# EAGLE schematic Reaccion (EAGLE 6.4)
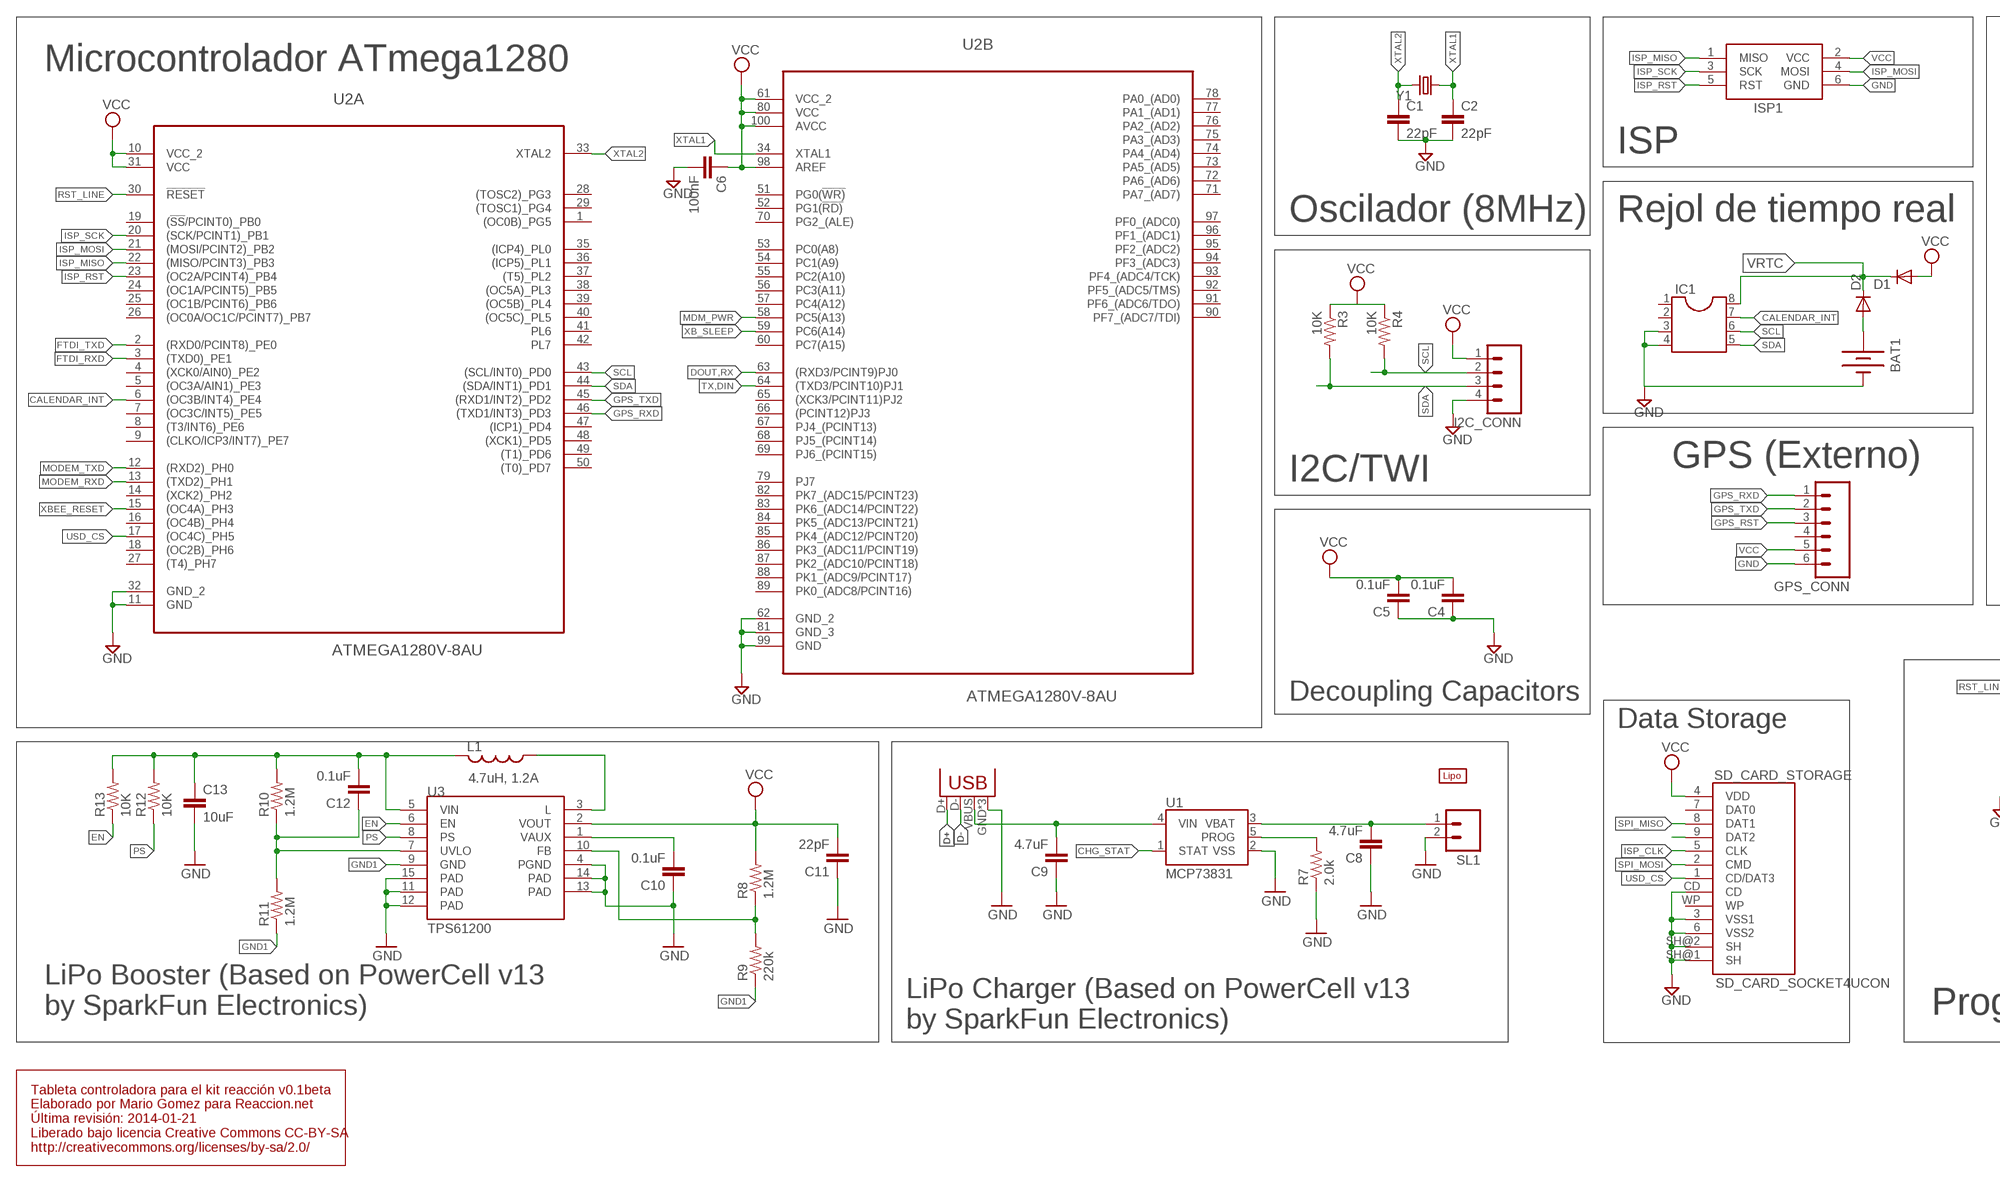
[diagram p0: schematic, sheet 1, part 1 of 2]
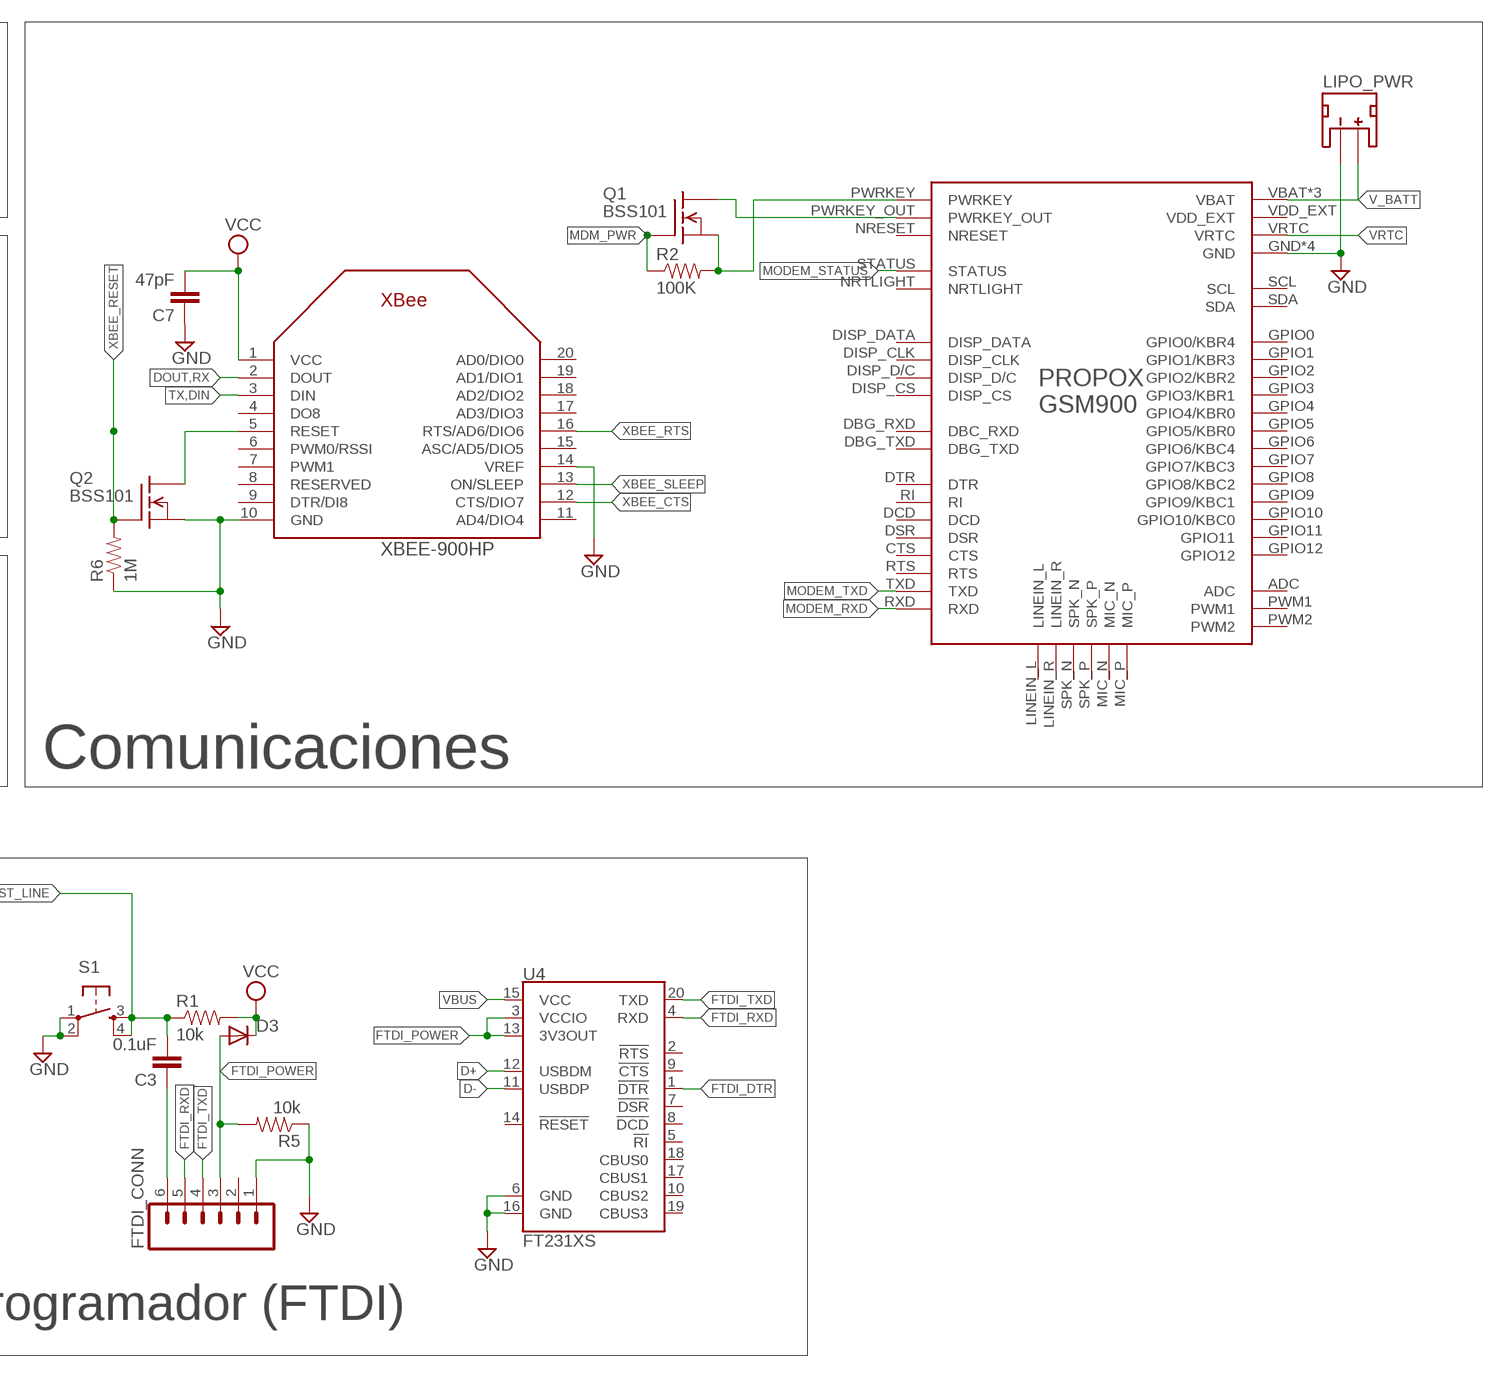
[diagram p1: schematic, sheet 1, part 2 of 2]

## Parts
BAT1  BATTERY12PTH  [BATTCON_12MM_PTH]
C1  22pF  CAP0805  [0805]
C2  22pF  CAP0805  [0805]
C3  0.1uF  CAP0805  [0805]
C4  0.1uF  1.0UF-25V-+80/-20(0805)  [0805]
C5  0.1uF  CAP0805  [0805]
C6  100nF  CAP0805  [0805]
C7  47pF  1.0UF-25V-+80/-20(0805)  [0805]
C8  4.7uF  4.7UF-6.3V-10%(0603)0603  [0603-CAP]
C9  4.7uF  4.7UF-6.3V-10%(0603)0603  [0603-CAP]
C10  0.1uF  1.0UF-25V-+80/-20(0805)  [0805]
C11  22pF  1.0UF-25V-+80/-20(0805)  [0805]
C12  0.1uF  1.0UF-25V-+80/-20(0805)  [0805]
C13  10uF  2.2UF-CERCAP-10009  [1206]
D1  DIODESOD  [SOD-323]
D2  DIODESOD  [SOD-323]
D3  DIODESOD  [SOD-323]
FTDI_CONN  M06SIP  [1X06]
GPS_CONN  M06SIP  [1X06]
GSM_MODEM  PROPOXGSM900  [CONN-13X2]
I2C_CONN  M04PTH  [1X04]
IC1  DIL8  [DIL08]
ISP1  AVRISP-6  [AVRISP]
JP1  USB-MICROB  [USB-MICROB]
L1  4.7uH, 1.2A  INDUCTOR.  [CDRH2D09]
LIPO_PWR  JST_2MM_MALE  [JST-2-SMD]
Q1  BSS101  [TO92]
Q2  BSS101  [TO92]
R1  10k  RESISTOR0805-RES  [0805]
R2  100K  RESISTOR0805-RES  [0805]
R3  10K  RESISTOR0805-RES  [0805]
R4  10K  RESISTOR0805-RES  [0805]
R5  10k  RESISTOR0805-RES  [0805]
R6  1M  RESISTOR0805-RES  [0805]
R7  2.0k  2.0KOHM1/10W5%(0603)  [0603-RES]
R8  1.2M  2.0KOHM1/10W5%(0603)  [0603-RES]
R9  220k  2.0KOHM1/10W5%(0603)  [0603-RES]
R10  1.2M  2.0KOHM1/10W5%(0603)  [0603-RES]
R11  1.2M  2.0KOHM1/10W5%(0603)  [0603-RES]
R12  10K  2.0KOHM1/10W5%(0603)  [0603-RES]
R13  10K  2.0KOHM1/10W5%(0603)  [0603-RES]
S1  TAC_SWITCHPTH  [TACTILE-PTH]
SD_CARD_STORAGE  SD_CARD_SOCKET4UCON  [SDCARD_4UCONN]
SL1  M02  [02P]
U1  MCP73831  [SOT23-5]
U2  ATMEGA1280V-8AU  [QFP50P1600X1600X120-100N]
U3  TPS61200  [QFN-10_PAD]
U4  FT231XS  [SSOP20_L]
U$2  LIPO-OUTLINE2000  [LIPO-2000]
XBEE-900HP  XBEE  [XBEE]
Y1  CRYSTAL10.5X4.8  [CRYSTAL-SMD-10.5X4.8-2PIN]

## Nets
CALENDAR_INT: IC1.7 U2.6(A:(OC3B/INT4)_PE4)
CHG_STAT: U1.1(STAT)
D+: JP1.D+ U4.12(USBDM)
D-: JP1.D- U4.11(USBDP)
DOUT,RX: U2.63(B:(RXD3/PCINT9)PJ0) XBEE-900HP.2(DOUT)
EN: R13.1 U3.6(EN)
FTDI_DTR: C3.1 FTDI_CONN.6 U4.1(!DTR)
FTDI_POWER: D3.2(A) FTDI_CONN.3 R5.2 U4.3(VCCIO) U4.13(3V3OUT)
FTDI_RXD: FTDI_CONN.5 U2.3(A:(TXD0)_PE1) U4.4(RXD)
FTDI_TXD: FTDI_CONN.4 U2.2(A:(RXD0/PCINT8)_PE0) U4.20(TXD)
GND: BAT1.GND(-) C1.2 C2.2 C4.1 C5.1 C6.2 C7.1 C8.1 C9.1 C10.1 C11.1 C13.2 FTDI_CONN.1 GPS_CONN.6 GSM_MODEM.GND GSM_MODEM.GND2(GND) GSM_MODEM.GND3(GND) GSM_MODEM.GND4(GND) I2C_CONN.4 IC1.3 IC1.4 ISP1.6(GND) JP1.GND JP1.MT1(GND) JP1.MT2(GND) LIPO_PWR.1(-) Q2.1(S) R5.1 R6.1 R7.1 S1.1 S1.2 SD_CARD_STORAGE.3(VSS1) SD_CARD_STORAGE.6(VSS2) SD_CARD_STORAGE.CD SD_CARD_STORAGE.SH@1(SH) SD_CARD_STORAGE.SH@2(SH) SL1.2 U1.2(VSS) U2.11(A:GND) U2.32(A:GND_2) U2.62(B:GND_2) U2.81(B:GND_3) U2.99(B:GND) U3.4(PGND) U3.11(PAD) U3.12(PAD) U3.13(PAD) U3.14(PAD) U3.15(PAD) U4.6(GND) U4.16(GND) XBEE-900HP.10(GND) XBEE-900HP.14(VREF)
GND1: R9.1 R11.1 U3.9(GND)
GPS_RST: GPS_CONN.3
GPS_RXD: GPS_CONN.1 U2.46(A:(TXD1/INT3)_PD3)
GPS_TXD: GPS_CONN.2 U2.45(A:(RXD1/INT2)_PD2)
ISP_CLK: SD_CARD_STORAGE.5(CLK)
ISP_MISO: ISP1.1(MISO) U2.22(A:(MISO/PCINT3)_PB3)
ISP_MOSI: ISP1.4(MOSI) U2.21(A:(MOSI/PCINT2)_PB2)
ISP_RST: ISP1.5(RST) U2.23(A:(OC2A/PCINT4)_PB4)
ISP_SCK: ISP1.3(SCK) U2.20(A:(SCK/PCINT1)_PB1)
MDM_PWR: Q1.2(G) R2.1 U2.58(B:PC5(A13))
MODEM_RXD: GSM_MODEM.RXD U2.13(A:(TXD2)_PH1)
MODEM_STATUS: GSM_MODEM.STATUS
MODEM_TXD: GSM_MODEM.TXD U2.12(A:(RXD2)_PH0)
N$1: BAT1.VCC@1(+) D2.2(A)
N$2: SD_CARD_STORAGE.9(DAT2)
N$4: R7.2 U1.5(PROG)
N$5: Q2.3(D) XBEE-900HP.5(RESET)
N$6: GSM_MODEM.PWRKEY_OUT Q1.3(D)
N$7: GSM_MODEM.PWRKEY Q1.1(S) R2.2
N$9: C10.2 U3.1(VAUX)
N$10: R8.1 R9.2 U3.10(FB)
N$11: L1.P$1 U3.3(L)
N$12: C12.1 R10.1 R11.2 U3.7(UVLO)
PS: R12.1 U3.8(PS)
RST_LINE: C3.2 R1.1 S1.3 S1.4 U2.30(A:!RESET)
SCL: I2C_CONN.2 IC1.6 R4.2 U2.43(A:(SCL/INT0)_PD0)
SDA: I2C_CONN.3 IC1.5 R3.2 U2.44(A:(SDA/INT1)_PD1)
SPI_MISO: SD_CARD_STORAGE.8(DAT1)
SPI_MOSI: SD_CARD_STORAGE.2(CMD)
TX,DIN: U2.64(B:(TXD3/PCINT10)PJ1) XBEE-900HP.3(DIN)
USD_CS: SD_CARD_STORAGE.1(CD/DAT3) U2.17(A:(OC4C)_PH5)
V_BATT: C8.2 C12.2 C13.1 GSM_MODEM.VBAT GSM_MODEM.VBAT2(VBAT) GSM_MODEM.VBAT3(VBAT) L1.P$2 LIPO_PWR.2(+) R10.2 R12.2 R13.2 SL1.1 U1.3(VBAT) U3.5(VIN)
VBUS: C9.2 JP1.VBUS U1.4(VIN) U4.15(VCC)
VCC: C4.2 C5.2 C6.1 C7.2 C11.2 D1.2(A) D3.1(C) GPS_CONN.5 I2C_CONN.1 ISP1.2(VCC) R1.2 R3.1 R4.1 R8.2 SD_CARD_STORAGE.4(VDD) U2.10(A:VCC_2) U2.31(A:VCC) U2.61(B:VCC_2) U2.80(B:VCC) U2.98(B:AREF) U2.100(B:AVCC) U3.2(VOUT) XBEE-900HP.1(VCC)
VRTC: D1.1(C) D2.1(C) GSM_MODEM.VRTC IC1.8
XB_SLEEP: U2.59(B:PC6(A14))
XBEE_CTS: XBEE-900HP.12(CTS/DIO7)
XBEE_RESET: Q2.2(G) R6.2 U2.15(A:(OC4A)_PH3)
XBEE_RTS: XBEE-900HP.16(RTS/AD6/DIO6)
XBEE_SLEEP: XBEE-900HP.13(ON/SLEEP)
XTAL1: C2.1 U2.34(B:XTAL1) Y1.P$1
XTAL2: C1.1 U2.33(A:XTAL2) Y1.P$2
Unconnected: FTDI_CONN.2 GPS_CONN.4 GSM_MODEM.ADC GSM_MODEM.CTS GSM_MODEM.DBG_RXD(DBC_RXD) GSM_MODEM.DBG_TXD GSM_MODEM.DCD GSM_MODEM.DISP_CLK GSM_MODEM.DISP_CS GSM_MODEM.DISP_D/C GSM_MODEM.DISP_DATA GSM_MODEM.DSR GSM_MODEM.DTR GSM_MODEM.GPIO0(GPIO0/KBR4) GSM_MODEM.GPIO1(GPIO1/KBR3) GSM_MODEM.GPIO2(GPIO2/KBR2) GSM_MODEM.GPIO3(GPIO3/KBR1) GSM_MODEM.GPIO4(GPIO4/KBR0) GSM_MODEM.GPIO5(GPIO5/KBR0) GSM_MODEM.GPIO6(GPIO6/KBC4) GSM_MODEM.GPIO7(GPIO7/KBC3) GSM_MODEM.GPIO8(GPIO8/KBC2) GSM_MODEM.GPIO9(GPIO9/KBC1) GSM_MODEM.GPIO10(GPIO10/KBC0) GSM_MODEM.GPIO11 GSM_MODEM.GPIO12 GSM_MODEM.LINEIN_L GSM_MODEM.LINEIN_R GSM_MODEM.MIC_N GSM_MODEM.MIC_P GSM_MODEM.NRESET GSM_MODEM.NRTLIGHT GSM_MODEM.PWM1 GSM_MODEM.PWM2 GSM_MODEM.RI GSM_MODEM.RTS GSM_MODEM.SCL GSM_MODEM.SDA GSM_MODEM.SPK_N GSM_MODEM.SPK_P GSM_MODEM.VDD_EXT IC1.1 IC1.2 LIPO_PWR.NC1(PAD1) LIPO_PWR.NC2(PAD2) SD_CARD_STORAGE.7(DAT0) SD_CARD_STORAGE.WP U2.1(A:(OC0B)_PG5) U2.4(A:(XCK0/AIN0)_PE2) U2.5(A:(OC3A/AIN1)_PE3) U2.7(A:(OC3C/INT5)_PE5) U2.8(A:(T3/INT6)_PE6) U2.9(A:(CLKO/ICP3/INT7)_PE7) U2.14(A:(XCK2)_PH2) U2.16(A:(OC4B)_PH4) U2.18(A:(OC2B)_PH6) U2.19(A:(!SS!/PCINT0)_PB0) U2.24(A:(OC1A/PCINT5)_PB5) U2.25(A:(OC1B/PCINT6)_PB6) U2.26(A:(OC0A/OC1C/PCINT7)_PB7) U2.27(A:(T4)_PH7) U2.28(A:(TOSC2)_PG3) U2.29(A:(TOSC1)_PG4) U2.35(A:(ICP4)_PL0) U2.36(A:(ICP5)_PL1) U2.37(A:(T5)_PL2) U2.38(A:(OC5A)_PL3) U2.39(A:(OC5B)_PL4) U2.40(A:(OC5C)_PL5) U2.41(A:PL6) U2.42(A:PL7) U2.47(A:(ICP1)_PD4) U2.48(A:(XCK1)_PD5) U2.49(A:(T1)_PD6) U2.50(A:(T0)_PD7) U2.51(B:PG0(!WR)) U2.52(B:PG1(!RD)) U2.53(B:PC0(A8)) U2.54(B:PC1(A9)) U2.55(B:PC2(A10)) U2.56(B:PC3(A11)) U2.57(B:PC4(A12)) U2.60(B:PC7(A15)) U2.65(B:(XCK3/PCINT11)PJ2) U2.66(B:(PCINT12)PJ3) U2.67(B:PJ4_(PCINT13)) U2.68(B:PJ5_(PCINT14)) U2.69(B:PJ6_(PCINT15)) U2.70(B:PG2_(ALE)) U2.71(B:PA7_(AD7)) U2.72(B:PA6_(AD6)) U2.73(B:PA5_(AD5)) U2.74(B:PA4_(AD4)) U2.75(B:PA3_(AD3)) U2.76(B:PA2_(AD2)) U2.77(B:PA1_(AD1)) U2.78(B:PA0_(AD0)) U2.79(B:PJ7) U2.82(B:PK7_(ADC15/PCINT23)) U2.83(B:PK6_(ADC14/PCINT22)) U2.84(B:PK5_(ADC13/PCINT21)) U2.85(B:PK4_(ADC12/PCINT20)) U2.86(B:PK3_(ADC11/PCINT19)) U2.87(B:PK2_(ADC10/PCINT18)) U2.88(B:PK1_(ADC9/PCINT17)) U2.89(B:PK0_(ADC8/PCINT16)) U2.90(B:PF7_(ADC7/TDI)) U2.91(B:PF6_(ADC6/TDO)) U2.92(B:PF5_(ADC5/TMS)) U2.93(B:PF4_(ADC4/TCK)) U2.94(B:PF3_(ADC3)) U2.95(B:PF2_(ADC2)) U2.96(B:PF1_(ADC1)) U2.97(B:PF0_(ADC0)) U4.2(!RTS) U4.5(!RI) U4.7(!DSR) U4.8(!DCD) U4.9(!CTS) U4.10(CBUS2) U4.14(!RESET) U4.17(CBUS1) U4.18(CBUS0) U4.19(CBUS3) XBEE-900HP.4(DO8) XBEE-900HP.6(PWM0/RSSI) XBEE-900HP.7(PWM1) XBEE-900HP.8(RESERVED) XBEE-900HP.9(DTR/DI8) XBEE-900HP.11(AD4/DIO4) XBEE-900HP.15(ASC/AD5/DIO5) XBEE-900HP.17(AD3/DIO3) XBEE-900HP.18(AD2/DIO2) XBEE-900HP.19(AD1/DIO1) XBEE-900HP.20(AD0/DIO0)

## Notes on the sheet
- Microcontrolador ATmega1280
- ISP
- Oscilador (8MHz) | Rejol de tiempo real
- GPS (Externo)
- I2C/TWI
- Comunicaciones
- Decoupling Capacitors
- Data Storage
- LiPo Booster (Based on PowerCell v13
  by SparkFun Electronics)
- Programador (FTDI)
- LiPo Charger (Based on PowerCell v13
  by SparkFun Electronics)
- Tableta controladora para el kit reacción v0.1beta
  Elaborado por Mario Gomez para Reaccion.net
  Última revisión: 2014-01-21
  Liberado bajo licencia Creative Commons CC-BY-SA
  http://creativecommons.org/licenses/by-sa/2.0/

## Library data of the parts
BAT1 = SparkFun-Electromechanical:BATTERY: Battery Holders Various common sizes : AA, AAA, 20mm coin cell and 12mm coin cell. 20MM_4LEGS, BATT-10373
C1-C3 C5 C6 = SparkFun-Capacitors:CAP: Capacitor Standard 0603 ceramic capacitor, and 0.1" leaded capacitor.
C4 C7 C10-C12 = SparkFun-Capacitors:1.0UF-25V-+80/-20(0805); PROD_ID: CAP-11625; VALUE: 1.0uF
C8 C9 = SparkFun-Capacitors:4.7UF-6.3V-10%(0603): CAP-08280; PROD_ID: CAP-08280
C13 = SparkFun-Capacitors:2.2UF-CER: 2.2uF Ceramic SMT CAP-07888- 10V, 20% (0603) CAP-10009- 50V, 10% (1206); PROD_ID: CAP-10009; VALUE: 2.2uF
D1-D3 = SparkFun-DiscreteSemi:DIODE: Diode These are standard reverse protection diodes and small signal diodes. SMA package can handle up to about 1A. SOD-323 can handle about 200mA. What the SOD-323 package when ordering, there are some mfgs out there that are 5-pin packages.; PROD_ID: DIO-09646
FTDI_CONN GPS_CONN = SparkFun-Connectors:M06: Header 6 Standard 6-pin 0.1" header. Use with straight break away headers (SKU : PRT-00116), right angle break away headers (PRT-00553), swiss pins (PRT-00743), machine pins (PRT-00117), and female headers (PRT-00115). Molex polarized connector foot print use with SKU : PRT-08094 with associated crimp pins and housings. NOTES ON THE VARIANTS LOCK and LOCK_LONGPADS... This footprint was designed to help hold the alignment of a through-hole component (i.e. 6-pin header) while soldering it into place. You may notice that each hole has been shifted either up or down by 0.005 of an inch from it's more standard position (which is a perfectly straight line). This slight alteration caused the pins (the squares in the middle) to touch the edges of the holes. Because they are alternating, it causes a "brace" to hold the component in place. 0.005 has proven to be the perfect amount of "off-center" position when using our standard breakaway headers. Although looks a little odd when you look at the bare footprint, once you have a header in there, the alteration is very hard to notice. Also,if you push a header all the way into place, it is covered up entirely on the bottom side. This idea of altering the position of holes to aid alignment will be further integrated into the Sparkfun Library for other footprints. It can help hold any component with 3 or more connection pins.
GSM_MODEM = PROPOX:PROPOXGSM900
I2C_CONN = SparkFun-Connectors:M04: Header 4 Standard 4-pin 0.1" header. Use with straight break away headers (SKU : PRT-00116), right angle break away headers (PRT-00553), swiss pins (PRT-00743), machine pins (PRT-00117), and female headers (PRT-00115). Molex polarized connector foot print use with SKU : PRT-08231 with associated crimp pins and housings. 1MM SMD Version SKU: PRT-10208
IC1 = ic-package:DIL8: Dual In Line / Socket
ISP1 = adafruit:AVRISP: AVR ISP HEADER Standard 6 pin header for AVR programming
JP1 = SparkFun-Connectors:USB: USB Connectors USB-B-PTH is fully proven SKU : PRT-00139/CONN-08278 USB-miniB is fully proven SKU : PRT-00587 USB-A-PCB is untested. USB-A-H is throughly reviewed, but untested. Spark Fun Electronics SKU : PRT-00437 USB-B-SMT is throughly reviewed, but untested. Needs silkscreen touching up. USB-A-S has not been used/tested USB-MB-H has not been used/tested USB-MICROB has been used. CONN-09505; PROD_ID: CONN-09505
L1 = SparkFun-Passives:INDUCTOR: Inductors Basic Inductor/Choke - 0603 and 1206. Footprints are not proven and vary greatly between part numbers. SRN6045- 33uH, 20% 1.4A SDR0403-560KL - 56uH, 10%, 500mA RMS/740mA peak
LIPO_PWR = SparkFun-Connectors:JST_2MM_MALE: Mates to single-cell LiPo batteries. CONN-08352; PROD_ID: CONN-08352
Q1 Q2 = transistor-fet:BSS101: N-Channel Enhancement MOSFET 200V; 0,16A; 11Ohm
R1-R6 = SparkFun-Passives:RESISTOR: Resistor Basic schematic elements and footprints for 0603, 1206, and PTH resistors.
R7 = SparkFun-Resistors:2.0KOHM1/10W5%(0603): RES-08296; PROD_ID: RES-08296
R8-R13 = SparkFun-Resistors:2.0KOHM1/10W5%(0603): RES-08296; PROD_ID: RES-08296; VALUE: 2.0k
S1 = SparkFun-Electromechanical:TAC_SWITCH: Momentary Switch Button commonly used for reset or general input. Spark Fun Electronics SKU : COM-00097 SMT- SWCH-08247
SD_CARD_STORAGE = SparkFun-Connectors:SD_CARD_SOCKET: SD Memory Card Connector, push-push normal type, CD enable, WP enable
SL1 = con-amp-quick:M02: AMP QUICK CONNECTOR; OC_FARNELL: unknown; OC_NEWARK: unknown
U1 = SparkFun-PowerIC:MCP73831: Miniature single cell, fully integrated Li-Ion, Li-polymer charge management controller http://ww1.microchip.com/downloads/en/DeviceDoc/21984a.pdf IC-09995; PROD_ID: IC-09995
U2 = ATMega1280:ATMEGA1280V-8AU: 8-bit Atmel Microcontroller with 64K/128K/256K Bytes In-System Programmable Flash,TQFP-100; MPN: ATMEGA1280V-8AU; OC_FARNELL: 1455091; OC_NEWARK: 68T2535; PACKAGE: TQFP-100; SUPPLIER: ATMEL
U3 = SparkFun-PowerIC:TPS61200: DC to DC Booster IC-10035; PROD_ID: IC-10035
U4 = SparkFun-DigitalIC:FT231X: FTDI FT231X Full Speed USB to Full-handshake UART This USB2.0 Full Speed IC offers a compact bridge to full handshake UART interfaces. The device is a UART, capable of operating up to 3MBaud, with low power consumption (8mA). The FT231X includes the complete FT-X series feature set and enables USB to be added into a system design quickly and easily over a UART interface.
U$2 = SparkFun-Electromechanical:LIPO-OUTLINE: Outlines for common LiPo batteries sold by SparkFun. For fit only- no pads or connectors!
XBEE-900HP = adafruit:XBEE
Y1 = SparkFun-FreqCtrl:CRYSTAL: Various standard crystals. Proven footprints. Spark Fun Electronics SKU : COM-00534